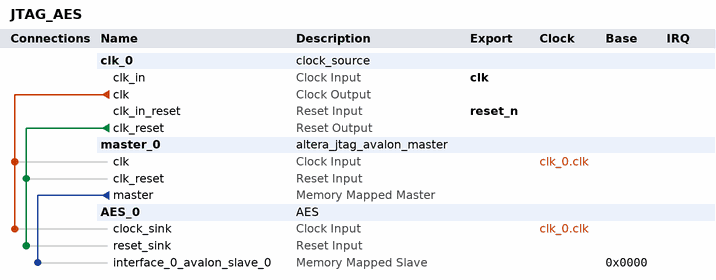
[diagram p0: system contents]
# Platform Designer (Qsys) system JTAG_AES, MAX 10 10M50DAF484C7G
# Parameters at their usual value, and those the tool derives, are not listed.
package require -exact qsys 18.0
create_system JTAG_AES
set_project_property DEVICE_FAMILY {MAX 10}
set_project_property DEVICE 10M50DAF484C7G

add_instance clk_0 clock_source 18.0
set_instance_parameter_value clk_0 clockFrequency 50000000

add_instance master_0 altera_jtag_avalon_master 18.0

add_instance AES_0 AES 1.0
set_instance_parameter_value AES_0 INTERFACE_ADDR_WIDTH 5
set_instance_parameter_value AES_0 INTERFACE_LENGTH 32
set_instance_parameter_value AES_0 INTERFACE_WIDTH 32

# connections
add_connection clk_0.clk AES_0.clock_sink clock
add_connection clk_0.clk master_0.clk clock
add_connection clk_0.clk_reset AES_0.reset_sink reset
add_connection clk_0.clk_reset master_0.clk_reset reset
add_connection master_0.master AES_0.interface_0_avalon_slave_0 avalon
set_connection_parameter_value master_0.master/AES_0.interface_0_avalon_slave_0 baseAddress 0x0000

# exported interfaces
add_interface clk clock sink
set_interface_property clk EXPORT_OF clk_0.clk_in
add_interface reset_n reset sink
set_interface_property reset_n EXPORT_OF clk_0.clk_in_reset

set_interconnect_requirement {$system} qsys_mm.clockCrossingAdapter HANDSHAKE
set_interconnect_requirement {$system} qsys_mm.enableEccProtection FALSE
set_interconnect_requirement {$system} qsys_mm.insertDefaultSlave FALSE
set_interconnect_requirement {$system} qsys_mm.maxAdditionalLatency 1

save_system JTAG_AES.qsys
